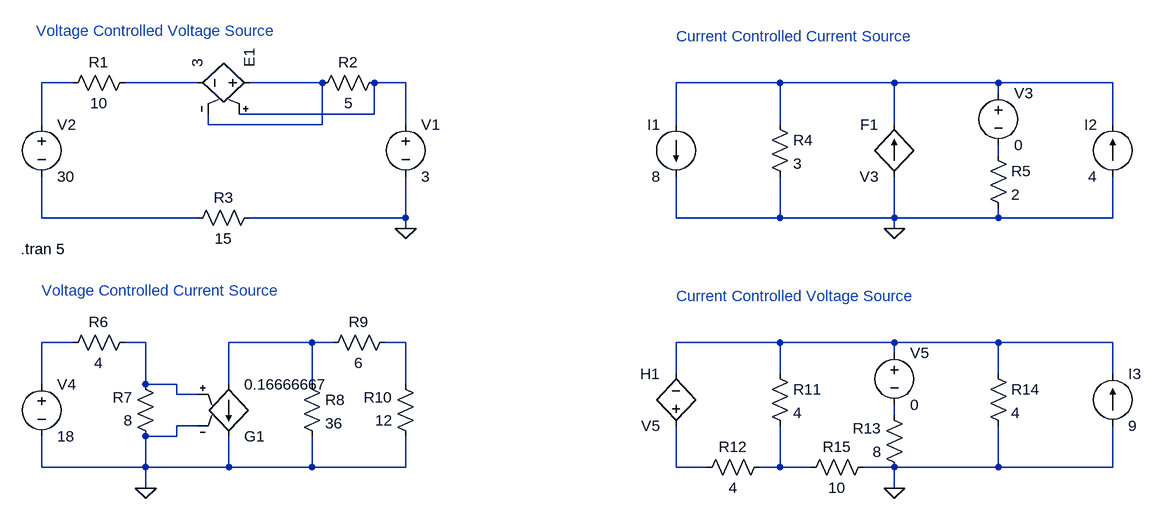
[diagram p0: schematic 02 Dependent Sources.asc]
02 Dependent Sources.asc, the LTspice schematic file:
Version 4
SHEET 1 1620 724
WIRE -32 80 -80 80
WIRE 160 80 48 80
WIRE 352 80 240 80
WIRE 480 80 432 80
WIRE 1056 80 896 80
WIRE 1232 80 1056 80
WIRE 1392 80 1232 80
WIRE 1568 80 1392 80
WIRE 1392 96 1392 80
WIRE 432 128 432 80
WIRE 432 128 224 128
WIRE -80 144 -80 80
WIRE 176 144 176 128
WIRE 352 144 352 80
WIRE 352 144 176 144
WIRE 480 144 480 80
WIRE 896 144 896 80
WIRE 1056 144 1056 80
WIRE 1232 144 1232 80
WIRE 1568 144 1568 80
WIRE 1392 192 1392 176
WIRE -80 288 -80 224
WIRE 160 288 -80 288
WIRE 480 288 480 224
WIRE 480 288 240 288
WIRE 896 288 896 224
WIRE 1056 288 1056 224
WIRE 1056 288 896 288
WIRE 1232 288 1232 224
WIRE 1232 288 1056 288
WIRE 1392 288 1392 272
WIRE 1392 288 1232 288
WIRE 1568 288 1568 224
WIRE 1568 288 1392 288
WIRE 480 304 480 288
WIRE 1232 304 1232 288
WIRE -32 480 -80 480
WIRE 80 480 48 480
WIRE 336 480 208 480
WIRE 368 480 336 480
WIRE 480 480 448 480
WIRE 1056 480 896 480
WIRE 1232 480 1056 480
WIRE 1392 480 1232 480
WIRE 1568 480 1392 480
WIRE 1232 496 1232 480
WIRE 896 528 896 480
WIRE 1056 528 1056 480
WIRE 1392 528 1392 480
WIRE 1568 528 1568 480
WIRE -80 544 -80 480
WIRE 80 544 80 480
WIRE 128 544 80 544
WIRE 208 544 208 480
WIRE 336 544 336 480
WIRE 480 544 480 480
WIRE 128 560 128 544
WIRE 160 560 128 560
WIRE 1232 592 1232 576
WIRE 160 608 128 608
WIRE 128 624 128 608
WIRE 128 624 80 624
WIRE -80 672 -80 624
WIRE 80 672 80 624
WIRE 80 672 -80 672
WIRE 208 672 208 624
WIRE 208 672 80 672
WIRE 336 672 336 624
WIRE 336 672 208 672
WIRE 480 672 480 624
WIRE 480 672 336 672
WIRE 896 672 896 608
WIRE 944 672 896 672
WIRE 1056 672 1056 608
WIRE 1056 672 1024 672
WIRE 1104 672 1056 672
WIRE 1232 672 1184 672
WIRE 1392 672 1392 608
WIRE 1392 672 1232 672
WIRE 1568 672 1568 608
WIRE 1568 672 1392 672
WIRE 80 704 80 672
WIRE 1232 704 1232 672
FLAG 480 304 0
FLAG 1232 304 0
FLAG 80 704 0
FLAG 1232 704 0
SYMBOL e 256 80 M270
SYMATTR InstName E1
SYMATTR Value 3
SYMBOL res 64 64 R90
WINDOW 0 0 56 VBottom 2
WINDOW 3 32 56 VTop 2
SYMATTR InstName R1
SYMATTR Value 10
SYMBOL res 448 64 R90
WINDOW 0 0 56 VBottom 2
WINDOW 3 32 56 VTop 2
SYMATTR InstName R2
SYMATTR Value 5
SYMBOL voltage 480 128 R0
WINDOW 123 0 0 Left 0
WINDOW 39 0 0 Left 0
SYMATTR InstName V1
SYMATTR Value 3
SYMBOL voltage -80 128 R0
WINDOW 123 0 0 Left 0
WINDOW 39 0 0 Left 0
SYMATTR InstName V2
SYMATTR Value 30
SYMBOL res 256 272 R90
WINDOW 0 0 56 VBottom 2
WINDOW 3 32 56 VTop 2
SYMATTR InstName R3
SYMATTR Value 15
SYMBOL current 896 144 M0
WINDOW 123 0 0 Left 0
WINDOW 39 0 0 Left 0
SYMATTR InstName I1
SYMATTR Value 8
SYMBOL res 1040 128 R0
SYMATTR InstName R4
SYMATTR Value 3
SYMBOL f 1232 224 R180
WINDOW 0 24 80 Left 2
WINDOW 3 24 0 Left 2
SYMATTR InstName F1
SYMATTR Value V3
SYMATTR Value2 3
SYMBOL current 1568 224 R180
WINDOW 0 24 80 Left 2
WINDOW 3 24 0 Left 2
WINDOW 123 0 0 Left 0
WINDOW 39 0 0 Left 0
SYMATTR InstName I2
SYMATTR Value 4
SYMBOL voltage 1392 80 R0
WINDOW 123 0 0 Left 0
WINDOW 39 0 0 Left 0
SYMATTR InstName V3
SYMATTR Value 0
SYMBOL res 1376 176 R0
SYMATTR InstName R5
SYMATTR Value 2
SYMBOL voltage -80 528 R0
WINDOW 123 0 0 Left 0
WINDOW 39 0 0 Left 0
SYMATTR InstName V4
SYMATTR Value 18
SYMBOL res 64 464 R90
WINDOW 0 0 56 VBottom 2
WINDOW 3 32 56 VTop 2
SYMATTR InstName R6
SYMATTR Value 4
SYMBOL res 96 640 R180
WINDOW 0 36 76 Left 2
WINDOW 3 36 40 Left 2
SYMATTR InstName R7
SYMATTR Value 8
SYMBOL g2 208 640 M180
SYMATTR InstName G1
SYMATTR Value 0.16666667
SYMBOL res 320 528 R0
SYMATTR InstName R8
SYMATTR Value 36
SYMBOL res 464 464 R90
WINDOW 0 0 56 VBottom 2
WINDOW 3 32 56 VTop 2
SYMATTR InstName R9
SYMATTR Value 6
SYMBOL res 496 640 R180
WINDOW 0 36 76 Left 2
WINDOW 3 36 40 Left 2
SYMATTR InstName R10
SYMATTR Value 12
SYMBOL h 896 624 R180
WINDOW 0 24 96 Left 2
WINDOW 3 24 16 Left 2
SYMATTR InstName H1
SYMATTR Value V5
SYMATTR Value2 20
SYMBOL res 1040 512 R0
SYMATTR InstName R11
SYMATTR Value 4
SYMBOL res 1040 656 R90
WINDOW 0 0 56 VBottom 2
WINDOW 3 32 56 VTop 2
SYMATTR InstName R12
SYMATTR Value 4
SYMBOL res 1248 688 R180
WINDOW 0 36 76 Left 2
WINDOW 3 36 40 Left 2
SYMATTR InstName R13
SYMATTR Value 8
SYMBOL voltage 1232 480 R0
WINDOW 123 0 0 Left 0
WINDOW 39 0 0 Left 0
SYMATTR InstName V5
SYMATTR Value 0
SYMBOL res 1376 512 R0
SYMATTR InstName R14
SYMATTR Value 4
SYMBOL current 1568 608 M180
WINDOW 0 24 80 Left 2
WINDOW 3 24 0 Left 2
WINDOW 123 0 0 Left 0
WINDOW 39 0 0 Left 0
SYMATTR InstName I3
SYMATTR Value 9
SYMBOL res 1200 656 R90
WINDOW 0 0 56 VBottom 2
WINDOW 3 32 56 VTop 2
SYMATTR InstName R15
SYMATTR Value 10
TEXT -88 0 Left 2 ;Voltage Controlled Voltage Source
TEXT -112 336 Left 2 !.tran 5
TEXT 896 8 Left 2 ;Current Controlled Current Source
TEXT -80 400 Left 2 ;Voltage Controlled Current Source
TEXT 896 408 Left 2 ;Current Controlled Voltage Source

The netlist it stands for:
* 02 Dependent Sources.asc
E1 N003 N002 N004 N003 3
R1 N002 N001 10
R2 N004 N003 5
V1 N004 0 3
V2 N001 N007 30
R3 0 N007 15
I1 N005 0 8
R4 N005 0 3
F1 0 N005 V3 3
I2 0 N005 4
V3 N005 N006 0
R5 N006 0 2
V4 N008 0 18
R6 N009 N008 4
R7 0 N009 8
G1 N010 0 N009 0 0.16666667
R8 N010 0 36
R9 N011 N010 6
R10 0 N011 12
H1 N014 N012 V5 20
R11 N012 N015 4
R12 N015 N014 4
R13 0 N013 8
V5 N012 N013 0
R14 N012 0 4
I3 0 N012 9
R15 0 N015 10
* Voltage Controlled Voltage Source
.tran 5
* Current Controlled Current Source
* Voltage Controlled Current Source
* Current Controlled Voltage Source
.backanno
.end